# EasyEDA Pro project Cmod_Spartan7_board_2025-09-22.epro, board PCB1
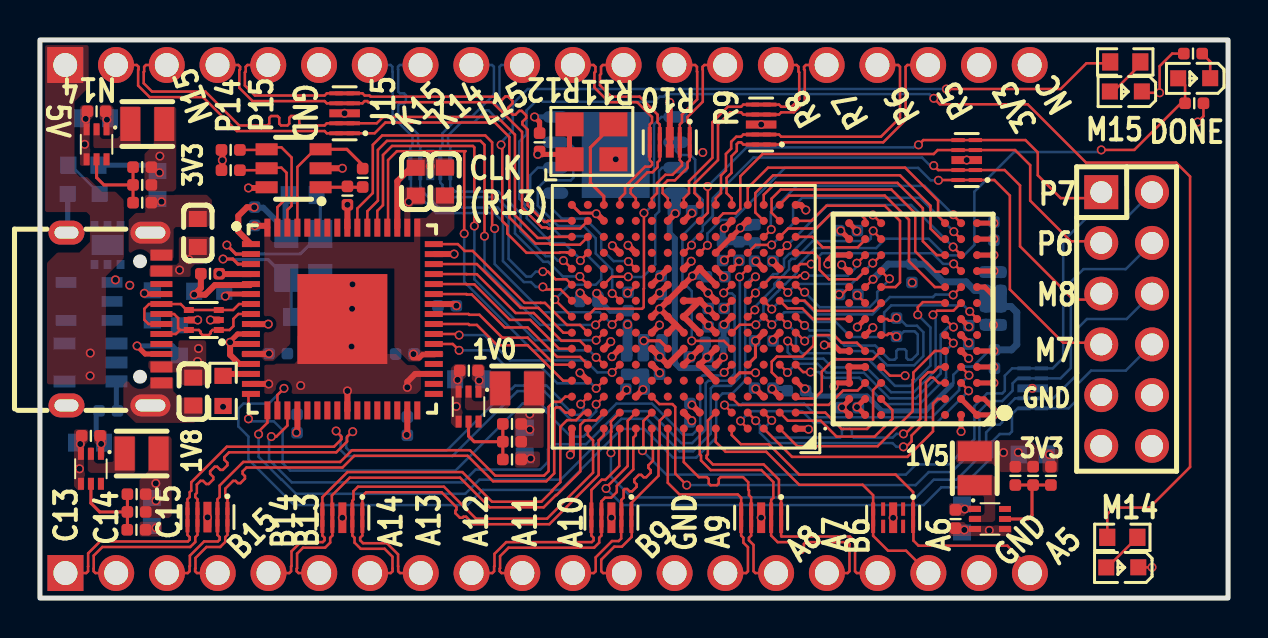
[diagram p1: board, top side]
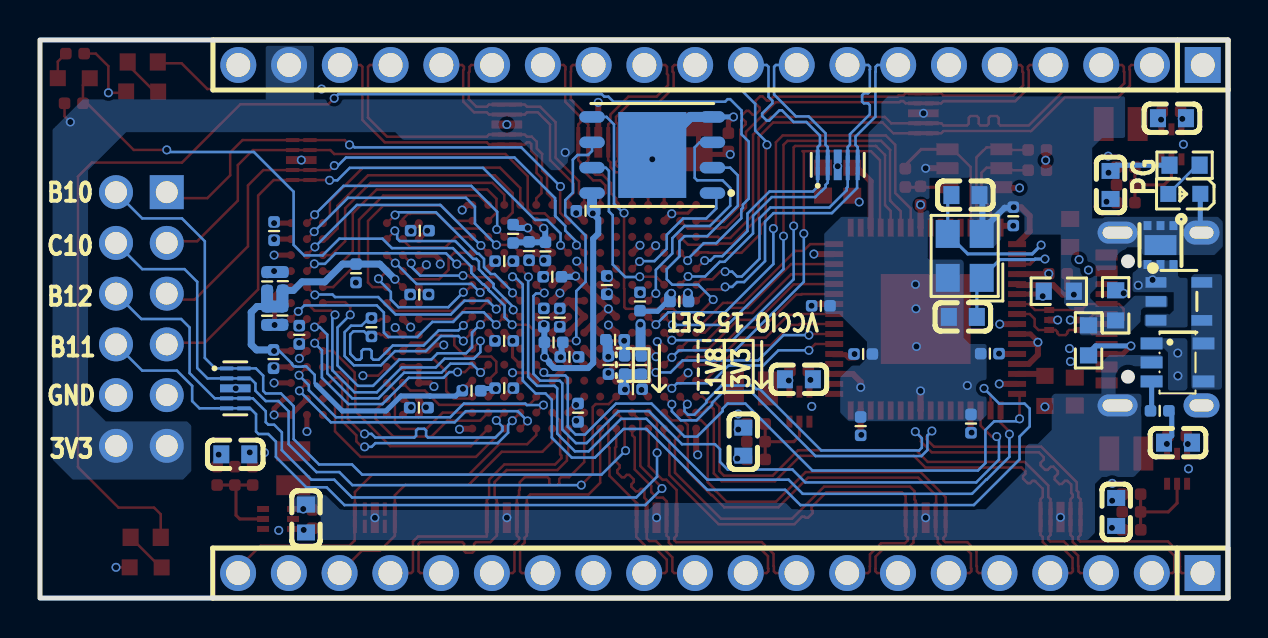
[diagram p2: board, bottom side, seen from below]

Outline 59.45 x 27.94 mm; copper layers: Top Layer, Inner1, Inner2, Bottom Layer. Coordinates in mm from the lower left corner of the outline.
Outline path: rectangle 0,27.94 59.45,0
Stack: Top Layer 0.035mm 外层铜厚1oz / Dielectric1 0.2104mm 7628 RC49% 8.6mil / Inner1 0.0152mm 内层铜厚 / Dielectric2 1.065mm 1.1mm H/HOZ Copper / Inner2 0.0152mm 内层铜厚 / Dielectric3 0.2104mm 7628 RC49% 8.6mil / Bottom Layer 0.035mm 外层铜厚1oz

## Design rules (mm)
net DDR_VREF: DDR
net DDR_CK_N: DDR, DP1
net DDR_CK_P: DDR, DP1
net DDR_A8: DDR
net DDR_A14: DDR
net DDR_A13: DDR
net DDR_RST_N: DDR
net DDR_A6: DDR
net DDR_A11: DDR
net DDR_A9: DDR
net DDR_A7: DDR
net DDR_A4: DDR
net DDR_A1: DDR
net DDR_A2: DDR
net DDR_A5: DDR
net DDR_BA1: DDR
net DDR_A12: DDR
net DDR_A0: DDR
net DDR_A3: DDR
net DDR_A15: DDR
net DDR_BA2: DDR
net DDR_BA0: DDR
net DDR_A10: DDR
net DDR_WE_N: DDR
net DDR_CS_N: DDR
net DDR_CKE: DDR
net DDR_CAS_N: DDR
net DDR_ODT: DDR
net DDR_RAS_N: DDR
net DDR_DQ5: DDR
net DDR_DQ7: DDR
net DDR_DQ4: DDR
net DDR_DQS_N: DDR, DP2
net DDR_DQ6: DDR
net DDR_DQ3: DDR
net DDR_DQ1: DDR
net DDR_DQS_P: DDR, DP2
net DDR_DQ2: DDR
net DDR_DM: DDR
net DDR_DQ0: DDR
net USB_DN: DP3
net USB_DP: DP3
net IO_L14P_C15: DP4
net IO_L14N_B15: DP4
net IO_L15N_C14: DP5
net IO_L15P_C13: DP5
net IO_L13P_B13: DP6
net IO_L13N_B14: DP6
net IO_L12P_A13: DP7
net IO_L12N_A14: DP7
net IO_L11P_A11: DP8
net IO_L11N_A12: DP8
net IO_L9P_B9: DP9
net IO_L9N_A10: DP9
net IO_L6P_A8: DP10
net IO_L6N_A9: DP10
net IO_L3P_B6: DP11
net IO_L3N_A7: DP11
net IO_L11P_P14: DP12
net IO_L11N_P15: DP12
net IO_L10P_N14: DP13
net IO_L10N_N15: DP13
net IO_L5P_J15: DP14
net IO_L5N_K15: DP14
net IO_L4N_L15: DP15
net IO_L4P_K14: DP15
net IO_L18N_R12: DP16
net IO_L18P_R11: DP16
net IO_L17P_R9: DP17
net IO_L17N_R10: DP17
net IO_L22P_R7: DP18
net IO_L22N_R8: DP18
net IO_L24P_R5: DP19
net IO_L24N_R6: DP19
template: 自定义配置
spacing copperThickness1oz (default): track to track 0.127, other pairs 0.11 to 0.3
spacing copperThickness2oz: track to track 0.203, other pairs 0.152 to 0.3
spacing copperThicknessInner0.5oz: track to track 0.089, other pairs 0.152 to 0.3
track width copperThickness1oz (default): min 0.102, default 0.127, max 2.54
track width copperThickness2oz: min 0.203, default 0.254, max 2.54
track width copperThickness0.5oz: min 0.089, default 0.254, max 2.54
differential pair differentialPair (default): width min 0.127, default 0.127, max 2.54; gap min 0.152, default 0.152
via viaSize (default): diameter min 0.3, default 0.45, max 10; hole min 0.2, default 0.305, max 6.3

## Placement (name value [footprint] x y rotation side)
C1  470nF  [C_0402 COPY(1)]  48.08 15.85 90 bottom
C9  470nF  [C_0402 COPY(1)]  36.22 10.51 180 bottom
C10  470nF  [C_0402 COPY(1)]  36.21 16.87 180 bottom
C13  470nF  [C_0402 COPY(1)]  36.22 12.87 0 bottom
C114  NAN  [C_0402 COPY(1)]  23.62 7.83 0 top
C115  22uF  [C0603]  24.26 7.83 90 bottom
C117  NAN  [C_0402 COPY(1)]  4.84 5.2 0 top
C118  22uF  [C0603]  5.6 4.31 90 bottom
C120  NAN  [C_0402 COPY(1)]  49.7 6.12 90 top
C121  22uF  [C0603]  49.68 7.2 180 bottom
C123  NAN  [C_0402 COPY(1)]  5.12 20.68 0 top
C124  22uF  [C0603]  5.88 20.68 90 bottom
C125  22uF  [C0603]  7.9 18.28 90 top
C126  470nF  [C_0402 COPY(1)]  21.46 11.38 0 top
C127  22uF  [C0603]  7.67 10.34 270 top
C128  NAN  [C_0402 COPY(1)]  2.55 8.12 0 top
C129  NAN  [C_0402 COPY(1)]  45.81 3.96 90 top
C130  NAN  [C_0402 COPY(1)]  2.83 24.37 0 top
C131  470nF  [C_0402 COPY(1)]  43.63 16.26 90 bottom
C132  470nF  [C_0402 COPY(1)]  37.85 10.38 0 bottom
C133  470nF  [C_0402 COPY(1)]  47.76 11.96 90 bottom
C134  470nF  [C_0402 COPY(1)]  46.47 13.18 90 bottom
C135  470nF  [C_0402 COPY(1)]  40.49 9.53 180 bottom
C136  470nF  [C_0402 COPY(1)]  40.44 18.39 180 bottom
C137  470nF  [C_0402 COPY(1)]  47.73 18.37 270 bottom
C139  470nF  [C_0402 COPY(1)]  48.08 14.14 90 bottom
C140  470nF  [C_0402 COPY(1)]  31 11.67 270 bottom
C141  470nF  [C_0402 COPY(1)]  32.96 12.07 180 bottom
C142  470nF  [C_0402 COPY(1)]  33.44 14.04 270 bottom
C143  470nF  [C_0402 COPY(1)]  31.09 15.67 270 bottom
C144  470nF  [C_0402 COPY(1)]  33.81 16.08 0 bottom
C145  18pF  [C0603]  13.27 14.07 0 bottom
C146  18pF  [C0603]  13.14 20.17 0 bottom
C147  470nF  [C_0402 COPY(1)]  8.51 16.24 180 top
C148  470nF  [C_0402 COPY(1)]  18.38 8.61 90 bottom
C149  470nF  [C_0402 COPY(1)]  12.86 8.73 90 bottom
C150  470nF  [C_0402 COPY(1)]  20.37 14.63 180 bottom
C153  470nF  [C_0402 COPY(1)]  10.75 19.11 90 bottom
C154  470nF  [C_0402 COPY(1)]  11.92 12.24 0 bottom
C155  470nF  [C_0402 COPY(1)]  18.26 12.22 180 bottom
C156  22uF  [C0603]  20.27 20.85 270 top
C157  22uF  [C0603]  18.8 20.84 270 top
C158  470nF  [C_0402 COPY(1)]  33.75 12.8 0 bottom
C159  470nF  [C_0402 COPY(1)]  35.77 18.24 270 bottom
C160  470nF  [C_0402 COPY(1)]  32.15 19.39 180 bottom
C161  470nF  [C_0402 COPY(1)]  27.46 14.85 180 bottom
C162  470nF  [C_0402 COPY(1)]  25 22.82 270 top
C163  470nF  [C_0402 COPY(1)]  29.78 10.46 0 bottom
C164  10uF  [C0603]  2.5 7.78 0 bottom
C165  10uF  [C0603]  2.81 24.02 0 bottom
C166  10uF  [C0603]  46.14 3.98 90 bottom
C167  10uF  [C0603]  21.47 10.95 0 bottom
C168  470nF  [C_0402 COPY(1)]  30.67 12.93 180 bottom
C169  470nF  [C_0402 COPY(1)]  32.52 9.28 90 bottom
D1  USBLC6-2P6  [SOT-666-6_L1.6-W1.2-P0.50-LS1.6-BL]  8.2 13.92 90 top
H3  -  [HDR-TH_20P-P2.54-V-M-1]  25.39 26.69 0 bottom
H4  -  [HDR-TH_20P-P2.54-V-M-1]  25.41 1.25 0 bottom
H5  -  [HDR-TH_12P-P2.54-V-M-R2-C6-S2.54]  54.37 13.97 270 top
L7  470nH  [IND-SMD_L2.0-W1.6-B]  23.87 10.5 180 top
L8  470nH  [IND-SMD_L2.0-W1.6-B]  5.09 7.23 180 top
L9  470nH  [IND-SMD_L2.0-W1.6-B]  46.77 6.5 270 top
L10  470nH  [IND-SMD_L2.0-W1.6-B]  5.37 23.73 180 top
LED1  -  [LED_0603]  54.29 25.35 180 top
LED2  -  [LED_0603]  54.11 1.53 180 top
LED3  -  [LED_0603]  2.24 20.23 0 bottom
LED4  -  [LED_0603]  57.71 26.02 180 top
R89  NAN  [R_0402 COPY(1)]  23.62 8.72 0 top
R90  NAN  [R_0402 COPY(1)]  23.62 6.94 180 top
R91  NAN  [R_0402 COPY(1)]  4.84 4.31 0 top
R92  NAN  [R_0402 COPY(1)]  4.83 3.42 180 top
R93  NAN  [R_0402 COPY(1)]  48.81 6.12 90 top
R94  NAN  [R_0402 COPY(1)]  50.58 6.12 270 top
R95  NAN  [R_0402 COPY(1)]  5.12 21.57 0 top
R96  NAN  [R_0402 COPY(1)]  5.12 19.79 180 top
R97  240R  [R_0402 COPY(1)]  40.47 15.19 0 bottom
R98  100R  [R_0402 COPY(1)]  42.86 13.56 270 bottom
R99  1K  [R_0402 COPY(1)]  47.3 15.86 90 bottom
R100  1K  [R_0402 COPY(1)]  47.32 14.15 90 bottom
R101  5K1  [R0603]  5.62 14.65 90 bottom
R102  5K1  [R0603]  6.98 12.9 270 bottom
R103  12K  [R0603]  8.47 15.36 0 bottom
R104  1K  [R0603]  9.16 10.37 90 top
R105  4.7K  [R_0402 COPY(1)]  34.98 17.37 270 bottom
R106  1K  [R_0402 COPY(1)]  34.16 17.35 270 bottom
R107  4.7K  [R_0402 COPY(1)]  34.24 14.04 90 bottom
R108  2.2K  [R_0402 COPY(1)]  16.15 21.04 90 top
R109  10K  [R_0402 COPY(1)]  15.39 20.15 90 top
R110  10K  [R_0402 COPY(1)]  9.54 21.42 0 top
R111  10K  [R_0402 COPY(1)]  9.54 22.44 0 top
R112  4.7K  [R_0402 COPY(1)]  29.43 14.85 90 bottom
R113  10K  [R0603]  54.31 26.84 180 top
R114  10K  [R0603]  54.16 3.04 180 top
R115  10K  [R0603]  2.17 21.67 0 bottom
R116  6.8K  [R_0402 COPY(1)]  3.42 9.37 0 bottom
R119  NAN  [R_0402 COPY(1)]  30.19 11.67 90 bottom
R120  NAN  [R_0402 COPY(1)]  29.36 11.66 90 bottom
R121  100R  [R_0402 COPY(1)]  57.7 27.26 180 top
R122  4.7K  [R_0402 COPY(1)]  57.76 24.77 180 top
U1  XC7S25-1CSGA225I  [CSGA-225_L13.0-W13.0-R15-C15-P0.80-TL]  32.22 14.08 180 top
U2  MT41K512M8DA-107 AIT:P  [FBGA-78_L10.5-W8.0-R13-C6-P0.80-TL]  43.69 13.97 180 top
U3  FT2232HQ-REEL  [QFN-64_L9.0-W9.0-P0.50-TL-EP4.3]  15.13 13.97 0 top
U11  TPS62A06DRLR  [SOT-563_L1.6-W1.2-P0.50-LS1.6-BR]  21.45 9.58 90 top
U12  TPS62A03ADRLR  [SOT-563_L1.6-W1.2-P0.50-LS1.6-BR]  2.55 6.47 90 top
U13  TPS62A03ADRLR  [SOT-563_L1.6-W1.2-P0.50-LS1.6-BR]  47.54 3.96 180 top
U14  TPS62A03ADRLR  [SOT-563_L1.6-W1.2-P0.50-LS1.6-BR]  2.83 22.72 90 top
U15  W25Q128JVPIQ  [WSON-8_L6.0-W5.0-P1.27-BL-EP]  28.81 22.18 90 bottom
U16  93LC56BT-I/OT  [SOT-23-6_L2.9-W1.6-P0.95-LS2.8-BR]  12.69 21.52 0 top
U20  ESD73034D-ES  [DFN2510-10_L2.5-W1.0-P0.50-BL]  8.38 4.05 180 top
U21  ESD73034D-ES  [DFN2510-10_L2.5-W1.0-P0.50-BL]  15.13 4.02 180 top
U22  ESD73034D-ES  [DFN2510-10_L2.5-W1.0-P0.50-BL]  28.59 4.02 180 top
U23  ESD73034D-ES  [DFN2510-10_L2.5-W1.0-P0.50-BL]  36.09 4.02 180 top
U24  ESD73034D-ES  [DFN2510-10_L2.5-W1.0-P0.50-BL]  42.69 4.02 180 top
U25  ESD73034D-ES  [DFN2510-10_L2.5-W1.0-P0.50-BL]  15.24 24.27 90 top
U26  ESD73034D-ES  [DFN2510-10_L2.5-W1.0-P0.50-BL]  19.53 21.69 180 bottom
U27  ESD73034D-ES  [DFN2510-10_L2.5-W1.0-P0.50-BL]  31.51 22.82 180 top
U28  ESD73034D-ES  [DFN2510-10_L2.5-W1.0-P0.50-BL]  36.09 23.7 90 top
U29  ESD73034D-ES  [DFN2510-10_L2.5-W1.0-P0.50-BL]  46.37 21.93 90 top
U30  ESD73034D-ES  [DFN2510-10_L2.5-W1.0-P0.50-BL]  49.68 10.5 270 bottom
U31  TVS0500DRVR  [WSON-6_L2.0-W2.0-P0.65-BL-EP]  3.38 17.67 0 bottom
U32  MAX40200AUK+T  [TSOT-23-5_L2.9-W1.6-P0.95-LS2.8-BL]  2.46 14.85 270 bottom
U33  MT9700  [SOT-23-5_L3.0-W1.7-P0.95-LS2.8-BR]  2.53 11.8 0 bottom
USB1  TYPE-C 16PIN 2MD(073)  [USB-C-SMD_TYPE-C-6PIN-2MD-073]  3.7 13.97 270 top
X1  12MHz  [CRYSTAL-SMD_4P-L3.2-W2.5-BL]  13.18 17.13 90 bottom
X2  50MHz  [OSC-SMD_4P-L3.2-W2.5-BL]  27.59 22.84 0 top

## Footprints (pads in the part's own frame, mm; a bottom-side part is the same pattern mirrored in y, then rotated)
C0603
  rect 0.8x0.9 smd: 1(-0.7,0) 2(0.7,0)
C_0402 COPY(1)
  custom 0.58x0.58 smd: 1(-0.46,0) 2(0.46,0)
CRYSTAL-SMD_4P-L3.2-W2.5-BL
  rect 1.4x1.2 smd: 1(-1.1,-0.85) 2(1.1,-0.85) 3(1.1,0.85) 4(-1.1,0.85)
CSGA-225_L13.0-W13.0-R15-C15-P0.80-TL
  round 0.4 smd: A1(-5.6,5.6) A2(-4.8,5.6) A3(-4,5.6) A4(-3.2,5.6) A5(-2.4,5.6) A6(-1.6,5.6) A7(-0.8,5.6) A8(0,5.6) A9(0.8,5.6) A10(1.6,5.6) A11(2.4,5.6) A12(3.2,5.6) A13(4,5.6) A14(4.8,5.6) A15(5.6,5.6) B1(-5.6,4.8) B2(-4.8,4.8) B3(-4,4.8) B4(-3.2,4.8) B5(-2.4,4.8) B6(-1.6,4.8) B7(-0.8,4.8) B8(0,4.8) B9(0.8,4.8) B10(1.6,4.8) B11(2.4,4.8) B12(3.2,4.8) B13(4,4.8) B14(4.8,4.8) B15(5.6,4.8) C1(-5.6,4) C2(-4.8,4) C3(-4,4) C4(-3.2,4) C5(-2.4,4) C6(-1.6,4) C7(-0.8,4) C8(0,4) C9(0.8,4) C10(1.6,4) C11(2.4,4) C12(3.2,4) C13(4,4) C14(4.8,4) C15(5.6,4) D1(-5.6,3.2) D2(-4.8,3.2) D3(-4,3.2) D4(-3.2,3.2) D5(-2.4,3.2) D6(-1.6,3.2) D7(-0.8,3.2) D8(0,3.2) D9(0.8,3.2) D10(1.6,3.2) D11(2.4,3.2) D12(3.2,3.2) D13(4,3.2) D14(4.8,3.2) D15(5.6,3.2) E1(-5.6,2.4) E2(-4.8,2.4) E3(-4,2.4) E4(-3.2,2.4) E5(-2.4,2.4) E6(-1.6,2.4) E7(-0.8,2.4) E8(0,2.4) E9(0.8,2.4) E10(1.6,2.4) E11(2.4,2.4) E12(3.2,2.4) E13(4,2.4) E14(4.8,2.4) E15(5.6,2.4) F1(-5.6,1.6) F2(-4.8,1.6) F3(-4,1.6) F4(-3.2,1.6) F5(-2.4,1.6) F6(-1.6,1.6) F7(-0.8,1.6) F8(0,1.6) F9(0.8,1.6) F10(1.6,1.6) F11(2.4,1.6) F12(3.2,1.6) F13(4,1.6) F14(4.8,1.6) F15(5.6,1.6) G1(-5.6,0.8) G2(-4.8,0.8) G3(-4,0.8) G4(-3.2,0.8) G5(-2.4,0.8) G6(-1.6,0.8) G7(-0.8,0.8) G8(0,0.8) G9(0.8,0.8) G10(1.6,0.8) G11(2.4,0.8) G12(3.2,0.8) G13(4,0.8) G14(4.8,0.8) G15(5.6,0.8) H1(-5.6,0) H2(-4.8,0) H3(-4,0) H4(-3.2,0) H5(-2.4,0) H6(-1.6,0) H7(-0.8,0) H8(0,0) H9(0.8,0) H10(1.6,0) H11(2.4,0) H12(3.2,0) H13(4,0) H14(4.8,0) H15(5.6,0) J1(-5.6,-0.8) J2(-4.8,-0.8) J3(-4,-0.8) J4(-3.2,-0.8) J5(-2.4,-0.8) J6(-1.6,-0.8) J7(-0.8,-0.8) J8(0,-0.8) J9(0.8,-0.8) J10(1.6,-0.8) J11(2.4,-0.8) J12(3.2,-0.8) J13(4,-0.8) J14(4.8,-0.8) J15(5.6,-0.8) K1(-5.6,-1.6) K2(-4.8,-1.6) K3(-4,-1.6) K4(-3.2,-1.6) K5(-2.4,-1.6) K6(-1.6,-1.6) K7(-0.8,-1.6) K8(0,-1.6) K9(0.8,-1.6) K10(1.6,-1.6) K11(2.4,-1.6) K12(3.2,-1.6) K13(4,-1.6) K14(4.8,-1.6) K15(5.6,-1.6) L1(-5.6,-2.4) L2(-4.8,-2.4) L3(-4,-2.4) L4(-3.2,-2.4) L5(-2.4,-2.4) L6(-1.6,-2.4) L7(-0.8,-2.4) L8(0,-2.4) L9(0.8,-2.4) L10(1.6,-2.4) L11(2.4,-2.4) L12(3.2,-2.4) L13(4,-2.4) L14(4.8,-2.4) L15(5.6,-2.4) M1(-5.6,-3.2) M2(-4.8,-3.2) M3(-4,-3.2) M4(-3.2,-3.2) M5(-2.4,-3.2) M6(-1.6,-3.2) M7(-0.8,-3.2) M8(0,-3.2) M9(0.8,-3.2) M10(1.6,-3.2) M11(2.4,-3.2) M12(3.2,-3.2) M13(4,-3.2) M14(4.8,-3.2) M15(5.6,-3.2) N1(-5.6,-4) N2(-4.8,-4) N3(-4,-4) N4(-3.2,-4) N5(-2.4,-4) N6(-1.6,-4) N7(-0.8,-4) N8(0,-4) N9(0.8,-4) N10(1.6,-4) N11(2.4,-4) N12(3.2,-4) N13(4,-4) N14(4.8,-4) N15(5.6,-4) P1(-5.6,-4.8) P2(-4.8,-4.8) P3(-4,-4.8) P4(-3.2,-4.8) P5(-2.4,-4.8) P6(-1.6,-4.8) P7(-0.8,-4.8) P8(0,-4.8) P9(0.8,-4.8) P10(1.6,-4.8) P11(2.4,-4.8) P12(3.2,-4.8) P13(4,-4.8) P14(4.8,-4.8) P15(5.6,-4.8) R1(-5.6,-5.6) R2(-4.8,-5.6) R3(-4,-5.6) R4(-3.2,-5.6) R5(-2.4,-5.6) R6(-1.6,-5.6) R7(-0.8,-5.6) R8(0,-5.6) R9(0.8,-5.6) R10(1.6,-5.6) R11(2.4,-5.6) R12(3.2,-5.6) R13(4,-5.6) R14(4.8,-5.6) R15(5.6,-5.6)
DFN2510-10_L2.5-W1.0-P0.50-BL
  rect 0.2x0.665 smd: 1(-1,-0.433) 2(-0.5,-0.433) 4(0.5,-0.433) 5(1,-0.433) 6(1,0.433) 7(0.5,0.433) 9(-0.5,0.433) 10(-1,0.433)
  rect 0.4x0.665 smd: 3(0,-0.433) 8(0,0.433)
FBGA-78_L10.5-W8.0-R13-C6-P0.80-TL
  round 0.4 smd: A1(-3.2,4.8) A2(-2.4,4.8) A3(-1.6,4.8) A7(1.6,4.8) A8(2.4,4.8) A9(3.2,4.8) B1(-3.2,4) B2(-2.4,4) B3(-1.6,4) B7(1.6,4) B8(2.4,4) B9(3.2,4) C1(-3.2,3.2) C2(-2.4,3.2) C3(-1.6,3.2) C7(1.6,3.2) C8(2.4,3.2) C9(3.2,3.2) D1(-3.2,2.4) D2(-2.4,2.4) D3(-1.6,2.4) D7(1.6,2.4) D8(2.4,2.4) D9(3.2,2.4) E1(-3.2,1.6) E2(-2.4,1.6) E3(-1.6,1.6) E7(1.6,1.6) E8(2.4,1.6) E9(3.2,1.6) F1(-3.2,0.8) F2(-2.4,0.8) F3(-1.6,0.8) F7(1.6,0.8) F8(2.4,0.8) F9(3.2,0.8) G1(-3.2,0) G2(-2.4,0) G3(-1.6,0) G7(1.6,0) G8(2.4,0) G9(3.2,0) H1(-3.2,-0.8) H2(-2.4,-0.8) H3(-1.6,-0.8) H7(1.6,-0.8) H8(2.4,-0.8) H9(3.2,-0.8) J1(-3.2,-1.6) J2(-2.4,-1.6) J3(-1.6,-1.6) J7(1.6,-1.6) J8(2.4,-1.6) J9(3.2,-1.6) K1(-3.2,-2.4) K2(-2.4,-2.4) K3(-1.6,-2.4) K7(1.6,-2.4) K8(2.4,-2.4) K9(3.2,-2.4) L1(-3.2,-3.2) L2(-2.4,-3.2) L3(-1.6,-3.2) L7(1.6,-3.2) L8(2.4,-3.2) L9(3.2,-3.2) M1(-3.2,-4) M2(-2.4,-4) M3(-1.6,-4) M7(1.6,-4) M8(2.4,-4) M9(3.2,-4) N1(-3.2,-4.8) N2(-2.4,-4.8) N3(-1.6,-4.8) N7(1.6,-4.8) N8(2.4,-4.8) N9(3.2,-4.8)
HDR-TH_12P-P2.54-V-M-R2-C6-S2.54
  rect 1.7x1.7 hole 1.1: 1(-6.35,-1.27)
  round 1.7 hole 1.1: 2(-6.35,1.27) 3(-3.81,-1.27) 4(-3.81,1.27) 5(-1.27,-1.27) 6(-1.27,1.27) 7(1.27,-1.27) 8(1.27,1.27) 9(3.81,-1.27) 10(3.81,1.27) 11(6.35,-1.27) 12(6.35,1.27)
HDR-TH_20P-P2.54-V-M-1
  rect 1.8x1.8 hole 1.2: 1(-24.13,0)
  round 1.8 hole 1.2: 2(-21.59,0) 3(-19.05,0) 4(-16.51,0) 5(-13.97,0) 6(-11.43,0) 7(-8.89,0) 8(-6.35,0) 9(-3.81,0) 10(-1.27,0) 11(1.27,0) 12(3.81,0) 13(6.35,0) 14(8.89,0) 15(11.43,0) 16(13.97,0) 17(16.51,0) 18(19.05,0) 19(21.59,0) 20(24.13,0)
IND-SMD_L2.0-W1.6-B
  rect 1x1.7 smd: 1(-0.85,0) 2(0.85,0)
LED_0603
  rect 0.8x0.8 smd: 1(-0.851,-0.01) 2(0.75,-0.005)
OSC-SMD_4P-L3.2-W2.5-BL
  rect 1.4x1.2 smd: 1(-1.1,-0.875) 2(1.1,-0.875) 3(1.1,0.875) 4(-1.1,0.875)
QFN-64_L9.0-W9.0-P0.50-TL-EP4.3
  rect 0.9x0.3 smd: 1(-4.575,3.75) 2(-4.575,3.25) 3(-4.575,2.75) 4(-4.575,2.25) 5(-4.575,1.75) 6(-4.575,1.25) 7(-4.575,0.75) 8(-4.575,0.25) 9(-4.575,-0.25) 10(-4.575,-0.75) 11(-4.575,-1.25) 12(-4.575,-1.75) 13(-4.575,-2.25) 14(-4.575,-2.75) 15(-4.575,-3.25) 16(-4.575,-3.75) 33(4.575,-3.75) 34(4.575,-3.25) 35(4.575,-2.75) 36(4.575,-2.25) 37(4.575,-1.75) 38(4.575,-1.25) 39(4.575,-0.75) 40(4.575,-0.25) 41(4.575,0.25) 42(4.575,0.75) 43(4.575,1.25) 44(4.575,1.75) 45(4.575,2.25) 46(4.575,2.75) 47(4.575,3.25) 48(4.575,3.75)
  rect 0.3x0.9 smd: 17(-3.75,-4.575) 18(-3.25,-4.575) 19(-2.75,-4.575) 20(-2.25,-4.575) 21(-1.75,-4.575) 22(-1.25,-4.575) 23(-0.75,-4.575) 24(-0.25,-4.575) 25(0.25,-4.575) 26(0.75,-4.575) 27(1.25,-4.575) 28(1.75,-4.575) 29(2.25,-4.575) 30(2.75,-4.575) 31(3.25,-4.575) 32(3.75,-4.575) 49(3.75,4.575) 50(3.25,4.575) 51(2.75,4.575) 52(2.25,4.575) 53(1.75,4.575) 54(1.25,4.575) 55(0.75,4.575) 56(0.25,4.575) 57(-0.25,4.575) 58(-0.75,4.575) 59(-1.25,4.575) 60(-1.75,4.575) 61(-2.25,4.575) 62(-2.75,4.575) 63(-3.25,4.575) 64(-3.75,4.575)
  rect 4.5x4.5 smd: 65(0,-0.001)
R0603
  rect 0.806x0.864 smd: 1(-0.753,0) 2(0.753,0)
R_0402 COPY(1)
  custom 0.58x0.58 smd: 1(-0.46,0) 2(0.46,0)
SOT-23-5_L3.0-W1.7-P0.95-LS2.8-BR
  rect 1.1x0.6 smd: 1(1.3,-0.95) 2(1.3,0) 3(1.3,0.95) 4(-1.3,0.95) 5(-1.3,-0.95)
SOT-23-6_L2.9-W1.6-P0.95-LS2.8-BR
  rect 1.1x0.6 smd: 1(1.35,-0.95) 2(1.35,0) 3(1.35,0.95) 4(-1.35,0.95) 5(-1.35,0) 6(-1.35,-0.95)
SOT-563_L1.6-W1.2-P0.50-LS1.6-BR
  rect 0.6x0.3 smd: 1(0.75,-0.5) 2(0.75,0) 3(0.75,0.5) 4(-0.75,0.5) 5(-0.75,0) 6(-0.75,-0.5)
SOT-666-6_L1.6-W1.2-P0.50-LS1.6-BL
  rect 0.3x0.5 smd: 1(-0.5,-0.75) 2(0,-0.75) 3(0.5,-0.75) 4(0.5,0.75) 5(0,0.75) 6(-0.5,0.75)
TSOT-23-5_L2.9-W1.6-P0.95-LS2.8-BL
  rect 0.532x1.045 smd: 1(-0.95,-1.147) 2(0,-1.147) 3(0.95,-1.147) 4(0.95,1.147) 5(-0.95,1.147)
USB-C-SMD_TYPE-C-6PIN-2MD-073
  rect 0.55x1.1 smd: 1(-3.2,2.375) 2(-2.4,2.375) 11(2.4,2.375) 12(3.2,2.375)
  rect 0.3x1.1 smd: 3(-1.75,2.375) 4(-1.25,2.375) 5(-0.75,2.375) 6(-0.25,2.375) 7(0.25,2.375) 8(0.75,2.375) 9(1.25,2.375) 10(1.75,2.375)
  oval 1.1x2 hole 0.6x1.5: 13(-4.325,1.825) 14(4.325,1.825)
  oval 1.2x1.8 hole 0.6x1.2: 13(-4.325,-2.375) 14(4.325,-2.375)
WSON-6_L2.0-W2.0-P0.65-BL-EP
  rect 0.4x0.45 smd: 1(-0.65,-0.975) 2(0,-0.975) 3(0.65,-0.975) 4(0.65,0.975) 5(0,0.975) 6(-0.65,0.975)
  rect 1.6x1 smd: 7(0,0)
WSON-8_L6.0-W5.0-P1.27-BL-EP
  oval 0.581x1.276 smd: 1(-1.905,-3.013) 2(-0.635,-3.013) 3(0.635,-3.013) 4(1.905,-3.013) 5(1.905,3.013) 6(0.635,3.013) 7(-0.635,3.013) 8(-1.905,3.013)
  rect 4.3x3.4 smd: 9(0,0)

## Nets
As in the schematic.

Pads without a net: H3 20; U1 C4 C6 C7 C8 C9 D3 D4 D7 D8 D9 D10 D11 D12 E3 E11 F2 F3 F4 F11 G4 G11 G12 H11 J11 K12 L10 L12 L13 L14 M3 M9 M10 M13 N4 N6 N7 N8 N9 N10 N11 N12 N13 P10 P11 P12 R14; U2 A3 A7 F1 F9 H1 H9; U3 21 22 23 24 26 27 28 29 30 32 33 34 36 57 58 59 60; U11 6; U12 6; U13 6; U14 6; U24 2 4 7 9; USB1 3 9

## Via types
v1: diameter 0.45, hole 0.305, Top Layer to Bottom Layer, 251 vias

## Routing (per net, layer and track width the routed paths; a pad name or vN(x,y) marks a point on that pad's centre or on a via; arc(x,y) is an arc through that point)
1V0: length 5.7
  Top Layer w0.3: v1(31.01,11.27) 31.01,11.29 U1.E10 ; U1.J10 v1(31.01,15.27) U1.K9 ; U1.E8 32.59,12.06 v1(32.59,12.07) 33.04,12.52 ; U1.H7 v1(33.45,13.65) U1.G6 ; 30.63,13.33 30.67,13.33 v1(31,13.67) ; U1.J6 v1(33.43,15.27) U1.K7
  vias: v1(24.51,9.22) v1(24.51,8.44)
1V8: length 11.7
  Top Layer w0.156: U1.D5 35.01,11.28 v1(35.81,11.28) ; v1(30.22,12.88) 31.02,12.88 U1.F9
  Top Layer w0.3: U1.L6 33.82,16.47 v1(34.21,16.07) ; U1.L8 32.22,16.49 v1(32.59,16.86)
  Inner2 w0.127: 34.25,16.09 34.09,16.09
  Inner2 w0.254: 35.08,9.56 34.86,9.34 34.85,9.34 34.57,9.06 34.57,9.06 34.42,8.9 34.42,8.56 ; v1(35.81,11.28) 34.94,11.28 ; 33.34,16.62 33.39,16.57 33.61,16.57 34.71,15.46 34.71,14.3 34.71,14.29 34.71,13.72 ; 30.12,15.96 30.12,16.09 30.88,16.85
  Bottom Layer w0.5: R119.2 30.19,12.86 v1(30.22,12.88)
  vias: v1(5.8,5.74) v1(5.8,4.87)
3V3: length 37.3
  Top Layer w0.127: R122.1 58.22,24.12 v1(57.93,23.83)
  Top Layer w0.254: X2.4 X2.1 26.25,22.21 v1(24.91,22.21)
  Top Layer w0.3: U1.P9 v1(31.79,19.25) ; 10.56,13.72 10.56,13.71 v1(11.42,13.71) ; U3.56 15.39,18.55 v1(15.39,19.69) ; U1.E6 v1(34.2,12.07) ; U1.J14 v1(27.03,15.27) ; v1(28.64,17.64) 29.01,17.27 29.02,17.27 ; U3.42 20.76,14.72 v1(20.84,14.63) ; 9.13,22.44 v1(9.13,21.92) 9.13,21.46 R110.1 ; v1(8.97,16.24) 8.99,16.22 10.56,16.22 ; U16.6 11.31,20.53 v1(10.43,20.53) ; 34.61,14.09 34.23,13.7 v1(34.23,13.7) ; v1(18.35,8.17) 18.38,8.2 U3.31 ; v1(12.83,8.28) 12.88,8.33 U3.20 ; U1.P5 34.25,18.52
  Bottom Layer w0.254: C124.2 5.59,21.67 R115.2
  Bottom Layer w0.3: v1(31.79,19.25) 31.51,18.98 31.51,18.24 31.77,17.99 31.77,11.77 32.02,11.51 33.65,11.51 33.66,11.52 33.72,11.52 33.97,11.76 33.97,11.83 v1(34.2,12.07) 34.2,12.74 34.18,12.76 ; 35.79,17.85 35.75,17.8 34.22,17.81 34.21,17.82 ; R107.1 34.21,13.55 C158.2 ; 34.19,18.52 34.17,18.5 34.17,17.79
  Bottom Layer w0.5: U15.8 31.82,19.33 31.8,19.3 ; 29.4,13.73 29.4,12.16 R120.2 ; 27.02,15.24 27.02,14.91 26.96,14.85
  vias: v1(6,22.12) v1(5.98,21.29) v1(9.16,9.58) v1(18.46,19.83) v1(29.41,13.69) v1(33.17,22.31) v1(34.25,18.51)
+1V5: length 12.4
  Top Layer w0.127: v1(43.29,11.13) 42.53,11.13 U2.D7
  Top Layer w0.254: 46.89,16.37 v1(47.73,16.37) ; 40.49,16.37 40.46,16.34 ; U2.A2 v1(46.09,8.34) ; U2.A9 40.49,9.19 v1(40.14,9.55) 40.49,9.9 U2.B9 ; U2.G2 46.48,13.58 v1(46.48,13.58) ; v1(39.24,12.67) 39.72,12.67 40.02,12.37 40.49,12.37 ; U2.G8 40.9,13.58 v1(40.9,13.56) ; U2.C1 v1(47.73,10.77) ; 40.46,16.34 v1(40.11,16.68) ; U2.M1 v1(47.73,17.97) ; U2.M9 v1(40.07,18.39) ; 46.13,12.34 v1(46.47,12)
  Top Layer w0.3: v1(35.82,16.87) 36.21,16.48 36.21,16.47 ; U1.G2 36.68,12.94 v1(36.68,12.92) ; 36.28,10.08 36.19,10.08 35.81,10.46 v1(35.81,10.47)
  Bottom Layer w0.6: R99.2 48.07,16.32 C1.2
  vias: v1(48.22,7.28) v1(48.95,7.29)
GND: length 101.2
  Top Layer w0.127: LED2.1 v1(55.64,1.54) ; U2.J9 40.12,15.2 v1(39.99,15.2) ; R121.2 56.66,27.26 56.03,26.63 v1(56.03,25.3) 55.15,25.3
  Top Layer w0.156: U1.E4 35.8,12.07 v1(35.8,12.88) ; 27.81,19.27 27.03,19.27 U1.R15
  Top Layer w0.2: U29.3 v1(46.37,21.93) U29.8
  Top Layer w0.254: U2.N9 40.88,18.38 v1(40.88,18.37) ; U2.D1 v1(47.73,11.57) ; v1(40.88,9.56) 40.9,9.56 U2.A8 ; U2.A1 v1(47.73,9.17) 47.73,9.48 47.25,9.97 U2.B1 ; v1(46.48,12.77) 46.48,12.78 U2.F2 ; 10.58,13.22 9.89,13.22 9.53,12.86 ; U2.L1 v1(47.73,17.17) ; 41.35,13.16 41.35,13.21 v1(41.67,13.54) ; v1(24.75,24.09) 25,23.83 C162.1 ; v1(47.71,13.67) 47.71,15.14 47.28,15.57 U2.J1 ; v1(39.73,10.59) 39.91,10.77 U2.C9 U2.D9 U2.D8 ; 40.86,9.56 40.86,9.56 41.28,9.98 ; U1.M6 U1.N5 35.04,18.51 ; U2.N1 v1(47.73,18.77) ; U2.B2 46.89,9.17 ; U2.L9 39.67,17.17 39.42,16.92 v1(39.42,16.72)
  Top Layer w0.3: v1(29.43,17.66) 29.44,17.66 U1.M11 ; U1.K6 U1.L7 U1.K8 U1.J9 v1(31.01,14.48) 31.02,14.48 U1.H9 31.82,13.68 ; 31.82,13.68 U1.G9 ; 31.82,13.68 U1.G8 ; v1(32.62,19.27) 32.6,19.27 U1.P8 ; 8.42,3.57 8.42,4 v1(8.39,4.04) ; 35.04,18.54 35.04,18.54 35.44,18.94 ; v1(31.51,24.81) U27.3 31.51,22.38 ; 28.59,4.45 v1(28.59,4.02) U22.8 ; U1.R1 38.07,19.68 v1(38.32,19.43) ; 10.56,17.72 9.92,18.35 9.92,19.13 10.36,19.56 v1(10.72,19.56) ; U25.8 v1(15.24,24.27) U25.3 ; v1(18.38,10.55) 18.38,10.83 18.77,11.22 U3.35 ; U23.8 v1(36.09,4.02) 36.09,4.45 ; v1(36.64,10.47) 36.64,10.46 U1.C2 ; v1(31.01,12.08) 30.62,12.47 U1.F10 U1.E9 U1.F8 ; 10.56,15.72 10.51,15.67 8.75,15.67 8.27,15.19 v1(7.72,15.19) 8.05,15.52 C147.2 ; U21.8 v1(15.13,4.02) 15.13,4.45 ; U28.3 v1(36.09,23.7) U28.8 ; U1.F6 v1(33.39,12.06) U1.E7 U1.D6 ; v1(28.56,12.84) 28.22,12.49 U1.F13 ; U1.H6 v1(33.46,14.44) U1.J7 ; U24.8 v1(42.69,4.02) 42.69,4.45 ; U1.D14 27.02,11.27 v1(27.02,11.27) ; U1.B8 32.22,9.28 v1(32.61,8.88) ; v1(15.39,10.37) 15.39,9.4 U3.25 ; v1(38.46,8.45) 38.43,8.48 37.8,8.48 ; C157.1 18.56,21.54 17.88,20.87 U3.51 ; U1.L9 v1(31,16.07) U1.K10 ; U1.J8 U1.J7 ; U1.J7 U1.H8 U1.G7 ; U1.A15 26.62,7.25 v1(26.54,7.17) ; v1(35.8,12.88) 35.82,12.88 36.25,13.32 ; 10.56,11.72 9.97,11.72 9.51,12.18 v1(9.51,12.81) ; U1.H10 31.01,14.47 ; 19.76,17.22 v1(20.72,17.22) ; v1(27.84,19.24) 27.86,19.24 U1.P13 ; 9.6,12.72 10.56,12.72 ; U1.C12 v1(29.35,10.42) ; U1.J13 27.86,15.24 ; U16.2 v1(15.13,21.52) ; 10.56,10.72 v1(11.45,10.72)
  Top Layer w0.35: v1(36.64,16.86) 36.64,16.86 U1.L2 ; D1.2 v1(8.53,13.92)
  Bottom Layer w0.254: USB1.13 1.39,18.36 LED3.1 ; 2.82,9.29 2.82,8.13 3.08,7.87 ; v1(24.75,24.09) U15.4 ; 28,14.9 28.54,14.36 29.43,14.36 ; 37.34,10.37 37.22,10.49 36.72,10.49
  Bottom Layer w0.3: 10.95,19.54 11.18,19.54 12.09,18.62 ; 35.73,18.72 35.53,18.53 v1(35.04,18.53) ; v1(32.65,16.12) 32.68,16.08 C144.1 ; U30.3 v1(49.65,10.5) U30.8 ; 12.37,20.19 12.29,20.12 12.29,18.62 ; U26.8 U26.3 ; 33.49,12.12 33.35,12.26 33.35,12.67 33.28,12.74 33.28,12.9
  Bottom Layer w0.5: 27.86,15.23 27.96,15.13 27.96,14.85 ; U15.9 26.91,24.09 U15.4 ; C168.1 31.04,12.84 31.04,12.06
  Bottom Layer w0.6: C139.1 47.33,13.68 47.32,13.69
  vias: v1(3.06,7.72) v1(3.35,23.95) v1(5.81,3.52) v1(6.08,19.84) v1(13.05,10.64) v1(15.64,15.7) v1(15.62,14.48) v1(15.59,12.59) v1(19.53,21.62) v1(21.98,10.89) v1(24.55,6.98) v1(27.86,15.25) v1(28.81,21.97) v1(43.64,15.79) v1(46.28,4.46) v1(50.51,7.18)
VCC:
  vias: v1(2.02,7.71) v1(1.98,6.47) v1(2.23,22.72) v1(2.29,23.99) v1(2.52,12.26) v1(2.51,11.12) v1(20.83,9.59) v1(20.9,10.92) v1(46.25,3.41) v1(47.5,3.39)
VCCIO_ADJ: length 4
  Top Layer w0.3: v1(30.17,10.44) 29.82,10.08 U1.C11 ; v1(28.62,12.08) 28.62,12.09 U1.F12 ; U1.B7 33.01,9.28 v1(32.62,9.67)
  Inner2 w0.156: 28.2,12.48 28.19,12.5 28.03,12.5 28.01,12.48 27.65,12.48 27.63,12.5 27.52,12.5
  Bottom Layer w0.254: v1(32.62,9.67) 32.57,9.71
  Bottom Layer w0.5: C163.2 30.24,11.17 R119.1 30.19,11.2 R120.1
DDR_A0: length 13
  Top Layer w0.127: 45.29,16.37 45.26,16.34 44.81,16.34 43.8,17.36 43.8,19.26 42.61,20.45 37.07,20.45 36.61,19.99 36.61,19.29 U1.P2
DDR_A1: length 6.1
  Top Layer w0.127: 36.99,15.69 37.03,15.69 v1(37.42,15.3) ; v1(41.67,16.77) 41.69,16.77 U2.L7
  Bottom Layer w0.127: v1(41.67,16.77) 41.66,16.78 41.66,16.78 40.6,15.73 37.85,15.73 v1(37.42,15.3)
DDR_A2: length 12.3
  Top Layer w0.127: U1.R3 36.22,20.19 36.81,20.78 42.91,20.78 44.18,19.51 44.18,17.86 44.87,17.17 U2.L3
DDR_A3: length 9
  Top Layer w0.127: v1(45.72,16.73) 45.73,16.73 46.09,16.37 ; U1.L1 38.05,16.72 v1(38.59,16.72)
  Bottom Layer w0.127: v1(38.59,16.72) 39.13,17.26 44.66,17.26 45.19,16.73 v1(45.72,16.73)
DDR_A4: length 5.9
  Top Layer w0.127: v1(40.88,16.76) 40.89,16.76 U2.L8 ; U1.K3 36.59,16.06 37.92,16.06 38,16.14 v1(38.28,16.14) ; 36.28,15.62 36.35,15.62
  Bottom Layer w0.127: v1(38.28,16.14) 40.42,16.14 40.88,16.59 v1(40.88,16.76)
DDR_A5: length 11.1
  Top Layer w0.127: v1(37.38,17.65) 37.38,17.64 37.05,17.31 ; v1(45.69,17.58) 46.09,17.18 U2.L2
  Bottom Layer w0.127: v1(45.69,17.58) 43.59,19.68 39.41,19.68 v1(37.38,17.65)
DDR_A6: length 3.9
  Top Layer w0.127: U2.M8 41.29,17.93 40.92,17.56 39.17,17.56 38.64,18.08 U1.N1
DDR_A7: length 13.2
  Top Layer w0.127: U2.M2 45.73,18.33 v1(45.73,18.34) ; v1(36.61,17.68) 35.81,17.68 U1.M4
  Bottom Layer w0.127: v1(36.61,17.68) 37.68,18.75 37.68,19.59 38.14,20.04 44.03,20.04 v1(45.73,18.34)
DDR_A8: length 5.1
  Top Layer w0.127: U1.N2 37.43,18.5 38.84,18.5 39.61,19.26 40.9,19.26 40.94,19.23 40.97,19.26 41,19.26 41.29,18.97 U2.N8
DDR_A9: length 13.4
  Top Layer w0.127: U1.P3 35.8,19.3 35.8,20.28 36.68,21.17 43.04,21.17 44.56,19.64 44.56,18.5 45.09,17.97 U2.M3
DDR_A10: length 4.6
  Top Layer w0.127: U1.J1 38.27,14.88 38.77,14.38 41.7,14.38 U2.H7
DDR_A11: length 9.2
  Top Layer w0.127: 35.46,14.11 35.77,14.43 ; U2.M7 41.69,18.37 v1(41.69,18.38)
  Bottom Layer w0.127: v1(35.77,14.43) 35.77,14.57 36.75,15.56 36.75,15.73 36.99,15.97 37,15.97 37.3,16.26 37.3,16.27 37.48,16.46 37.48,16.85 37.62,16.98 37.78,16.98 38.67,17.87 41.45,17.87 41.57,18 41.57,18.26 v1(41.69,18.38)
DDR_A12: length 6.6
  Top Layer w0.127: v1(42.51,15.98) 42.48,15.98 42.09,16.37 ; v1(38.27,15.31) 38.19,15.31 U1.K1
  Bottom Layer w0.127: v1(38.27,15.31) 39.01,14.56 41.51,14.56 41.89,14.94 41.89,15.32 42.51,15.94 v1(42.51,15.98)
DDR_A13: length 12.7
  Top Layer w0.127: U2.N3 44.94,19.12 44.94,19.9 43.29,21.55 36.43,21.55 35.42,20.53 U1.R4
DDR_A14: length 9
  Top Layer w0.127: v1(35.8,15.27) 35.8,15.27 U1.J4 ; v1(41.68,19.18) 42.09,18.77 U2.N7
  Bottom Layer w0.127: 36.89,16.23 37.23,16.56 37.23,16.97 37.49,17.23 37.56,17.23 39.64,19.31 41.54,19.31 v1(41.68,19.18) ; 35.8,15.32 36.69,16.22 36.89,16.22
DDR_A15: length 10
  Top Layer w0.127: U1.P1 38.59,18.88 39.35,19.64 42.27,19.64 43.04,18.88 43.04,15.8 42.81,15.57 U2.J7
DDR_BA0: length 11.1
  Top Layer w0.127: U1.J3 36.62,14.48 v1(36.62,14.47) ; 46.12,15.55 46.06,15.55 v1(45.69,15.18)
  Bottom Layer w0.127: v1(45.69,15.18) 45.67,15.2 44.81,15.2 44.69,15.07 42.53,15.07 41.65,14.2 38.89,14.2 38.21,14.88 37.03,14.88 v1(36.62,14.47)
DDR_BA1: length 4.5
  Top Layer w0.127: 41.29,16.37 41.29,16.37 40.88,15.96 39.48,15.96 39.01,16.43 39.01,17 38.73,17.28 U1.M1
DDR_BA2: length 11.6
  Top Layer w0.127: U1.R2 37.48,20.15 42.27,20.15 43.48,18.94 43.48,16.86 44.78,15.57 U2.J3
DDR_CAS_N: length 13
  Top Layer w0.127: v1(37.4,11.29) 37.4,11.3 U1.E2 ; U2.G3 45.69,13.57 v1(45.71,13.57)
  Bottom Layer w0.127: v1(45.71,13.57) 45.45,13.57 45.07,13.19 45.07,11.25 43.82,10 42.51,10 41.23,11.28 39.36,11.28 38.91,11.73 37.84,11.73 v1(37.4,11.29)
DDR_CK_N: length 11.2
  Top Layer w0.127: U2.G7 42.39,13.97 42.48,13.88 42.61,13.88 42.74,14.02 v1(42.86,14.02) ; 37.83,13.3 v1(38.26,12.87)
  Bottom Layer w0.127: R98.1 42.98,14.02 43.36,13.63 43.88,13.63 44.2,13.31 44.2,12.11 43.74,11.65 42.39,11.65 41.68,12.36 40.14,12.36 39.38,13.12 38.52,13.12 v1(38.26,12.87)
DDR_CK_P: length 11
  Top Layer w0.127: v1(38.26,13.65) 38.25,13.65 U1.H1 ; v1(42.86,13.09) 42.74,13.09 42.59,13.24 42.47,13.24 42.39,13.17 U2.F7
  Bottom Layer w0.127: R98.2 42.98,13.1 43.23,13.35 43.77,13.35 43.92,13.2 43.92,12.23 43.63,11.93 43.44,11.93 43.35,12.02 43.35,12.37 43.26,12.46 42.94,12.46 42.85,12.37 42.85,12.02 42.76,11.93 42.51,11.93 41.79,12.64 40.25,12.64 39.5,13.4 38.51,13.4 v1(38.26,13.65)
DDR_CKE: length 4
  Top Layer w0.127: U2.G9 38.68,13.97 38.15,14.5 37.41,14.5 36.94,14.97
DDR_CS_N: length 14.3
  Top Layer w0.127: U1.F1 37.43,12.87 v1(37.41,12.87) ; v1(44.69,14.18) 44.89,14.38 45.71,14.38 U2.H2
  Bottom Layer w0.127: v1(44.69,14.18) 44.82,14.05 44.82,11.4 43.72,10.3 42.59,10.3 41.35,11.55 39.64,11.55 39.2,11.98 37.74,11.98 37.41,12.31 v1(37.41,12.87)
DDR_DM: length 7.7
  Top Layer w0.127: U2.B7 42.65,9.41 42.65,8.97 41.77,8.08 39.86,8.08 39.07,8.88 37.42,8.88 U1.B2
DDR_DQ0: length 11.7
  Top Layer w0.127: U2.B3 44.92,9.97 44.69,9.73 44.69,8.35 43.41,7.07 37.63,7.07 U1.A3
DDR_DQ1: length 6.5
  Top Layer w0.127: U2.C7 42.05,10.77 41.69,10.41 41.69,8.77 41.38,8.47 40.11,8.47 39.3,9.28 U1.B1
DDR_DQ2: length 13.6
  Top Layer w0.127: v1(46.47,10.37) 46.47,10.39 U2.C2 ; U1.A4 35.05,8.85 v1(35.05,8.87)
  Bottom Layer w0.127: v1(46.47,10.37) 44.89,8.8 38.7,8.8 38.14,9.35 35.54,9.35 v1(35.05,8.87)
DDR_DQ3: length 7.4
  Top Layer w0.127: 34.56,10.09 34.97,9.67 39.47,9.67 40.19,10.39 40.91,10.39 U2.C8
DDR_DQ4: length 11.7
  Top Layer w0.127: 45.29,12.37 44.78,12.37 43.7,11.29 43.7,10.96 43.67,10.93 43.67,9.36 41.92,7.6 37.9,7.6 U1.A2
DDR_DQ5: length 6.9
  Top Layer w0.127: 41.29,12.37 40.88,12.78 40.11,12.78 39.73,13.16 38.84,13.16 38.72,13.04 38.72,12.66 38.15,12.09 36.87,12.09 36.62,11.84 36.62,11.3 37.04,10.88
DDR_DQ6: length 14.7
  Top Layer w0.127: U2.D2 46.49,11.17 v1(46.49,11.15) ; U1.B5 34.25,9.65 v1(34.25,9.66)
  Bottom Layer w0.127: v1(46.49,11.15) 45.99,10.66 45.99,10.41 44.64,9.05 38.92,9.05 38.24,9.73 35.16,9.73 35.09,9.66 v1(34.25,9.66)
DDR_DQ7: length 5.9
  Top Layer w0.127: 42.09,12.37 41.68,11.96 39.74,11.96 39.12,11.34 39.12,10.36 38.75,9.99 37.91,9.99 U1.C1
DDR_DQS_N: length 13.6
  Top Layer w0.127: U2.D3 44.96,11.57 44.7,11.31 44.44,11.31 44.05,10.92 44.05,8.97 43.29,8.21 43.22,8.21 v1(43.21,8.22) ; v1(36.62,8.89) 36.61,8.89 U1.B3
  Bottom Layer w0.127: v1(36.62,8.89) 36.3,8.58 36.3,8.39 36.66,8.03 40.04,8.03 40.13,8.12 40.13,8.38 40.22,8.47 40.54,8.47 40.63,8.38 40.63,8.12 40.72,8.03 42.67,8.03 42.86,8.22 v1(43.21,8.22)
DDR_DQS_P: length 13.7
  Top Layer w0.127: v1(35.81,8.88) 35.81,8.89 U1.B4 ; v1(43.2,7.57) 43.34,7.57 43.62,7.84 43.62,8.14 44.33,8.86 44.33,10.8 44.56,11.03 44.7,11.03 44.96,10.77 U2.C3
  Bottom Layer w0.127: v1(43.2,7.57) 42.85,7.57 42.67,7.76 36.54,7.76 36.02,8.27 36.02,8.67 v1(35.81,8.88)
DDR_ODT: length 13.2
  Top Layer w0.127: 36.16,14.08 36.22,14.08 v1(36.62,13.68) ; v1(46.52,14.35) 46.89,13.98 U2.G1
  Bottom Layer w0.127: v1(46.52,14.35) 46.22,14.65 42.59,14.65 42.24,14.3 42.24,13.29 42.01,13.07 40.57,13.07 39.82,13.82 38.77,13.82 38.29,14.31 37.24,14.31 v1(36.62,13.68)
DDR_RAS_N: length 11.3
  Top Layer w0.127: 45.7,12.78 45.32,13.17 U2.F3 ; U1.E1 38.18,11.31 v1(38.55,11.31)
  Bottom Layer w0.127: v1(45.7,12.76) 45.34,12.4 45.34,11.03 44.02,9.71 42.31,9.71 40.99,11.03 39.25,11.03 38.97,11.31 v1(38.55,11.31)
DDR_RST_N: length 12.3
  Top Layer w0.127: v1(45.7,19.19) 45.7,19.16 U2.N2 ; v1(36.59,18.45) 36.23,18.08 U1.N3
  Bottom Layer w0.127: v1(45.7,19.19) 44.26,20.63 37.87,20.63 36.57,19.34 36.57,18.45
DDR_VREF: length 26
  Top Layer w0.127: v1(41.69,15.96) 41.3,15.57 U2.J8
  Top Layer w0.254: v1(38.28,10.47) 38.23,10.47 U1.D1 ; 46.89,12.37 v1(47.73,12.37)
  Bottom Layer w0.127: 46.67,11.61 46.75,11.61 46.84,11.69 46.84,11.74 47.51,12.41 47.65,12.41 ; 46.66,11.6 46.64,11.58 46.3,11.58 46.28,11.6 46.13,11.6 45.7,11.17 45.7,10.75 45.62,10.67
  Bottom Layer w0.254: 45.62,10.67 44.32,9.37 42.13,9.37 41.38,10.12 39.94,10.12 39.93,10.11 38.64,10.11 v1(38.28,10.47)
  Bottom Layer w0.35: C139.2 48.59,14.59 48.88,14.31 48.88,12.69 48.61,12.42 C133.2 ; v1(41.69,15.96) 42.45,16.72 C131.2 44.31,16.72 45.19,15.83 46.34,15.83 46.77,15.4 R99.1
  Bottom Layer w0.6: C1.1 48.08,15.38 C139.2 47.33,14.59 R100.2 47.32,15.38 R99.1
DDR_WE_N: length 14.5
  Top Layer w0.127: v1(43.92,14.18) 43.92,14.56 44.18,14.81 45.24,14.81 U2.H3 ; 37.01,14.08 v1(37.41,13.69)
  Bottom Layer w0.127: v1(43.92,14.18) 44.56,13.55 44.56,11.64 43.54,10.62 42.78,10.62 41.47,11.94 39.87,11.94 39.55,12.26 38.13,12.26 37.83,12.55 37.83,13.29 37.39,13.73
EECLK: length 6.4
  Top Layer w0.127: R111.2 11.31,22.44 U16.4 11.44,22.56 12.08,22.56 12.59,22.05 12.59,19.64 12.38,19.43 U3.62
EECS: length 5.4
  Top Layer w0.127: R110.2 11.24,21.42 U16.5 11.37,21.55 12.08,21.55 12.34,21.29 12.34,20.02 11.88,19.57 U3.63
EEDATA: length 7.2
  Top Layer w0.127: U3.61 12.88,21.58 13.77,22.47 U16.3
  Top Layer w0.156: U16.3 15.36,22.47 16.15,21.67 R108.2
FIFO_D2: length 8.1
  Top Layer w0.127: U3.40 21.43,13.72 21.48,13.67 21.86,13.67 22.88,12.66 24.4,12.66 26.17,10.88 U1.D15
FIFO_D3: length 8
  Top Layer w0.127: U1.E15 25.76,11.68 24.4,13.04 23.13,13.04 21.99,14.18 21.48,14.18 21.44,14.22 U3.41
FIFO_D4: length 9.2
  Top Layer w0.127: U3.43 21.33,15.22 21.35,15.2 21.61,15.2 23.26,13.55 24.4,13.55 25.88,12.07 27.03,12.07 U1.E14
FIFO_D5: length 8.2
  Top Layer w0.127: U3.44 21.34,15.72 21.35,15.7 21.74,15.7 23.51,13.93 24.53,13.93 25.97,12.48 U1.F15
FIFO_D6: length 9.3
  Top Layer w0.127: U3.45 21.35,16.22 21.35,16.21 21.86,16.21 23.8,14.27 24.7,14.27 26.1,12.88 27.02,12.88 U1.F14
FIFO_D7: length 8.3
  Top Layer w0.127: U3.46 21.86,16.72 24.06,14.53 24.95,14.53 26.19,13.28 U1.G15
FIFO_RD: length 23
  Top Layer w0.127: v1(27.83,12.91) 27.84,12.91 U1.G13 ; v1(21.74,18.62) 21.74,22.56 21.67,22.63 17.61,22.63 17.16,22.18 17.16,19.67 16.88,19.39 U3.53
  Bottom Layer w0.127: v1(21.74,18.62) 21.74,15.96 24.78,12.91 27.83,12.91
FIFO_RXF: length 9.5
  Top Layer w0.127: U1.G14 27.03,13.67 26.37,13.67 25.27,14.78 25.06,14.78 25.05,14.78 24.25,14.78 21.65,17.38 21.25,17.38 20.91,17.72 U3.48
FIFO_SIWUB: length 24.6
  Top Layer w0.127: U3.55 15.88,19.5 16.66,20.28 16.66,22.69 17.12,23.16 22.28,23.16 22.62,22.82 22.62,18.62 v1(22.75,18.5) ; U1.H12 28.63,13.7 v1(28.63,13.69)
  Bottom Layer w0.127: v1(22.75,18.5) 22.75,16.72 25.16,14.31 28.01,14.31 v1(28.63,13.69)
FIFO_TXE: length 22.7
  Top Layer w0.127: U1.E13 27.85,12.05 v1(27.83,12.05) ; U3.52 17.42,18.58 17.42,21.93 17.86,22.37 21.29,22.37 21.23,22.31 v1(21.23,18.24)
  Bottom Layer w0.127: v1(27.83,12.05) 27.48,12.4 24.66,12.4 21.23,15.83 v1(21.23,18.24)
FIFO_WR: length 23.2
  Top Layer w0.127: U1.H13 27.8,13.67 27.8,13.67 ; v1(22.24,18.12) 22.24,22.69 22.05,22.89 17.36,22.89 16.91,22.44 16.91,19.9 16.38,19.37 U3.54
  Bottom Layer w0.127: v1(27.8,13.68) 27.8,13.67 25.04,13.67 22.24,16.47 v1(22.24,18.12)
FT_1V8: length 2.7
  Top Layer w0.254: 18.65,12.02 18.98,12.02 19.14,12.18 19.76,12.18
  Top Layer w0.3: 10.56,12.22 11.45,12.22 ; U3.64 11.29,18.64 v1(10.75,18.64)
  vias: v1(11.46,12.24) v1(18.69,12.21)
IO_L3N_A7: length 15.9
  Top Layer w0.127: U23.9 36.59,3.13 36.92,2.8 37.64,2.8 37.73,2.71 37.73,2.36 37.82,2.27 38.14,2.27 38.23,2.36 38.23,2.71 38.32,2.8 40.42,2.8 40.51,2.71 40.51,1.34 40.42,1.25 H4.16 ; U1.A7 33.02,7.2 33.08,7.13 33.08,6.89 33.56,6.41 36.1,6.41 36.7,5.81 36.7,5.02 36.59,4.91 36.59,4.45
  Top Layer w0.2: 36.59,4.45 U23.9
IO_L3P_B6: length 15.9
  Top Layer w0.127: U23.10 37.09,3.1 37.11,3.08 40.53,3.08 40.79,2.83 40.79,1.34 40.87,1.25 H4.17 ; 37.09,4.45 37.09,4.91 36.98,5.02 36.98,5.92 36.21,6.69 33.67,6.69 33.36,7 33.36,7.13 33.42,7.2 33.42,8.89 U1.B6
  Top Layer w0.2: 37.09,4.45 U23.10
IO_L4N_L15: length 18.6
  Top Layer w0.127: v1(26.19,16.89) 26.21,16.89 U1.L15
  Bottom Layer w0.127: U26.10 20.53,22.58 20.42,22.69 20.42,23.15 21.1,23.83 21.74,23.83 22.32,24.42 22.45,24.42 22.96,23.9 23.09,23.9 23.31,24.13 23.31,24.26 22.8,24.77 22.8,24.9 22.99,25.09 22.99,26.6 23.08,26.69 H3.10 ; U26.1 20.53,20.59 20.77,20.35 22.94,20.35 24.05,19.25 24.05,18.37 25.3,17.11 25.68,17.11 25.91,16.89 v1(26.19,16.89)
  Bottom Layer w0.2: U26.10 U26.1
IO_L4P_K14: length 18.6
  Top Layer w0.127: v1(27.02,16.1) 27.02,16.08 U1.K14
  Bottom Layer w0.127: H3.9 22.62,26.69 22.71,26.6 22.71,25.21 21.62,24.11 20.98,24.11 20.14,23.27 20.14,22.69 20.03,22.58 U26.9 ; U26.2 20.03,20.79 20.14,20.68 20.14,20.57 20.33,20.37 20.35,20.37 20.65,20.07 22.83,20.07 23.77,19.13 23.77,18.26 25.19,16.83 25.43,16.83 26.17,16.1 v1(27.02,16.1)
  Bottom Layer w0.2: U26.9 U26.2
IO_L5N_A6: length 15.2
  Top Layer w0.127: U1.A6 33.82,7.81 34.31,7.32 36.34,7.32 37.99,5.67 41.17,5.67 41.69,5.15 41.69,4.45 ; H4.18 43.34,2.37 42.44,2.37 41.69,3.12 U24.6
  Top Layer w0.2: 41.69,4.45 U24.6
IO_L5N_K15: length 19.3
  Top Layer w0.127: v1(25.16,16.34) 25.42,16.34 25.8,15.96 26.34,15.96 U1.K15
  Bottom Layer w0.127: 19.04,26.69 18,26.69 17.91,26.6 17.91,26.47 17.93,26.46 17.93,25.36 18.02,25.27 18.22,25.27 18.31,25.18 18.31,24.86 18.22,24.77 18.02,24.77 17.93,24.68 17.93,24.21 18.92,23.22 18.92,22.69 19.03,22.58 U26.7 ; U26.4 19.03,20.58 19.08,20.53 19.08,20.42 19.95,19.55 22.9,19.55 23.45,19 23.45,16.98 24.33,16.1 24.57,16.1 24.81,16.34 v1(25.16,16.34)
  Bottom Layer w0.2: U26.7 U26.4
IO_L5P_A5: length 19.7
  Top Layer w0.127: H4.20 49.54,1.49 48.41,2.62 43.96,2.62 43.71,2.88 43.71,3.57 U24.10 ; 43.69,4.45 43.69,5.31 42.82,6.18 37.99,6.18 36.47,7.7 35.07,7.7 34.62,8.16 U1.A5
  Top Layer w0.2: 43.69,4.45 U24.10
IO_L5P_J15: length 19.3
  Top Layer w0.127: v1(25.16,15.58) 25.29,15.45 26.05,15.45 U1.J15
  Bottom Layer w0.127: U26.6 18.53,22.58 18.64,22.69 18.64,23.1 17.65,24.1 17.65,26.34 17.63,26.35 17.63,26.6 17.55,26.69 H3.7 ; U26.5 18.56,21.22 18.56,20.53 19.82,19.27 22.74,19.27 23.17,18.85 23.17,16.87 24.22,15.82 24.57,15.82 24.81,15.58 v1(25.16,15.58)
  Bottom Layer w0.2: U26.6 U26.5
IO_L6N_A9: length 11.7
  Top Layer w0.127: U1.A9 31.42,5.77 32,5.19 34.92,5.19 35.09,5.02 35.09,4.45 ; H4.14 35.34,1.25 35.43,1.34 35.43,2.55 35.2,2.77 35.2,3.02 35.09,3.13 U23.6
  Top Layer w0.2: 35.09,4.45 U23.6
IO_L6P_A8: length 11.7
  Top Layer w0.127: U1.A8 32.22,6.81 32.97,6.05 33.37,6.05 33.46,5.96 33.46,5.74 33.55,5.65 33.87,5.65 33.96,5.74 33.96,5.96 34.05,6.05 35.19,6.05 35.44,5.8 35.44,5.43 35.48,5.39 35.48,5.15 35.59,5.04 35.59,4.45 ; U23.7 35.59,3.13 35.48,3.02 35.48,2.89 35.7,2.66 35.7,1.34 35.8,1.25 H4.15
  Top Layer w0.2: 35.59,4.45 U23.7
IO_L9N_A10: length 10.7
  Top Layer w0.127: 29.09,4.45 29.09,4.91 29.2,5.02 29.2,5.41 29.26,5.46 29.38,5.46 29.5,5.34 29.63,5.34 29.85,5.57 29.85,5.69 29.74,5.81 29.74,5.94 29.96,6.17 30.09,6.17 30.21,6.05 30.33,6.05 30.56,6.27 30.56,6.4 30.44,6.52 30.44,6.65 30.67,6.87 30.67,7.52 30.62,7.58 U1.A10 ; U22.9 29.08,3.58 29.08,2.98 28.96,2.85 28.62,2.85 27.81,2.04 27.81,1.34 27.72,1.25 H4.11
  Top Layer w0.2: 29.09,4.45 U22.9
IO_L9P_B9: length 10.7
  Top Layer w0.127: U22.10 29.61,3.57 29.61,3.06 29.12,2.57 28.74,2.57 28.08,1.92 28.08,1.34 28.17,1.25 H4.12 ; 29.59,4.45 29.59,4.77 30.95,6.12 30.95,7.52 31.01,7.58 31.01,8.87 U1.B9
  Top Layer w0.2: 29.59,4.45 U22.10
IO_L10N_N15: length 30.8
  Top Layer w0.127: 6.34,26.69 5.3,26.69 5.21,26.6 5.21,26.35 5.19,26.33 5.19,25.77 5.61,25.36 8.27,25.36 9.97,23.66 11.38,23.66 11.47,23.75 11.47,24.04 11.56,24.13 11.88,24.13 11.97,24.04 11.97,23.75 12.06,23.66 12.38,23.66 12.47,23.75 12.47,24.04 12.56,24.13 12.88,24.13 12.97,24.04 12.97,23.75 13.06,23.66 14.24,23.66 14.35,23.77 U25.9 ; U25.2 16.85,23.77 17.17,24.09 22.88,24.09 23.77,23.2 23.77,19.17 24.91,18.03 25.47,18.03 25.53,18.08 26.62,18.08
  Top Layer w0.2: U25.2 U25.9
IO_L10P_N14: length 30.9
  Top Layer w0.127: H3.2 4.84,26.69 4.93,26.6 4.93,26.47 4.91,26.45 4.91,25.66 5.49,25.08 8.16,25.08 9.86,23.38 14.24,23.38 14.35,23.27 U25.10 ; U1.N14 27.02,17.69 25.55,17.69 25.5,17.75 24.8,17.75 23.49,19.05 23.49,23.08 22.76,23.81 17.29,23.81 16.75,23.27 U25.1
  Top Layer w0.2: U25.1 U25.10
IO_L11N_A12: length 13.6
  Top Layer w0.127: 28.28,5.91 28.99,6.61 28.99,8.45 U1.A12 ; U22.6 27.59,3.13 27.7,3.02 27.7,2.89 27.61,2.8 23.33,2.8 22.74,2.21 22.74,1.6 22.73,1.58 22.73,1.34 22.64,1.25 H4.9 ; 27.59,4.45 27.59,5.41 28.11,5.92 28.27,5.92
  Top Layer w0.2: 27.59,4.45 U22.6
IO_L11N_P15: length 25.1
  Top Layer w0.127: U25.6 14.35,25.27 14.24,25.16 10.75,25.16 10.25,25.66 10.25,26.31 10.29,26.35 10.29,26.6 10.38,26.69 H3.5 ; U25.5 16.14,25.27 16.25,25.16 16.49,25.16 16.55,25.1 22.75,25.1 22.95,24.9 23.08,24.9 23.29,25.11 23.42,25.11 23.64,24.89 23.64,24.76 23.43,24.55 23.43,24.42 23.66,24.2 23.79,24.2 23.98,24.39 24.11,24.39 24.33,24.16 24.33,24.03 24.14,23.84 24.14,23.71 24.4,23.45 24.4,19.66 25.23,18.83 25.36,18.83 25.41,18.88 U1.P15
  Top Layer w0.2: U25.5 U25.6
IO_L11P_A11: length 13.8
  Top Layer w0.127: 28.09,4.45 28.09,4.84 28.27,5.03 28.58,5.03 28.86,5.31 28.86,5.61 29.69,6.44 29.69,8.03 29.82,8.16 U1.A11 ; U22.7 28.09,3.13 27.98,3.02 27.98,2.77 27.73,2.52 23.45,2.52 23.02,2.1 23.02,1.49 23.01,1.47 23.01,1.34 23.09,1.25 H4.10
  Top Layer w0.2: 28.09,4.45 U22.7
IO_L11P_P14: length 25.1
  Top Layer w0.127: U25.7 14.35,24.77 14.24,24.88 10.64,24.88 9.97,25.54 9.97,26.43 10.01,26.47 10.01,26.6 9.92,26.69 8.88,26.69 ; U25.4 16.14,24.77 16.25,24.88 16.37,24.88 16.43,24.82 22.64,24.82 24.12,23.34 24.12,19.55 25.12,18.55 25.37,18.55 25.42,18.5 27.03,18.5 U1.P14
  Top Layer w0.2: U25.4 U25.7
IO_L12N_A14: length 22.7
  Top Layer w0.127: 15.63,4.45 15.63,4.87 15.69,4.93 15.69,5.35 15.91,5.58 20.21,5.58 21.81,3.98 25.37,3.98 27.68,6.28 27.68,7.9 27.42,8.16 U1.A14 ; U21.9 15.63,3.13 15.74,3.02 15.74,2.77 16.05,2.47 17.24,2.47 17.64,2.07 17.64,1.48 17.65,1.47 17.65,1.34 17.56,1.25 H4.7
  Top Layer w0.2: 15.63,4.45 U21.9
IO_L12P_A13: length 22.8
  Top Layer w0.127: U1.A13 28.22,8.16 27.96,7.9 27.96,6.16 25.49,3.7 21.7,3.7 21.32,4.07 21.19,4.07 21.14,4.02 21.01,4.02 20.79,4.25 20.79,4.37 20.84,4.43 20.84,4.55 20.1,5.3 16.32,5.3 16.13,5.11 16.13,4.45 ; H4.8 18.02,1.25 17.92,1.34 17.92,1.58 17.92,1.59 17.92,2.19 17.36,2.75 16.17,2.75 16.02,2.89 16.02,3.02 16.13,3.13 U21.10
  Top Layer w0.2: 16.13,4.45 U21.10
IO_L13N_B14: length 24.2
  Top Layer w0.127: 25.64,5.37 25.62,5.35 ; 25.62,5.35 25.09,4.82 22.62,4.82 21.13,6.31 15.39,6.31 14.13,5.05 14.13,4.45 ; 25.62,5.35 25.62,5.39 26.04,5.81 26.04,8.57 26.37,8.91 26.83,8.91 27.2,9.28 U1.B14 ; H4.5 12.48,1.25 12.57,1.34 12.57,1.58 12.59,1.61 12.59,2.34 13.05,2.8 14.15,2.8 14.24,2.89 14.24,3.02 14.13,3.13 U21.6
  Top Layer w0.2: 14.13,4.45 U21.6
IO_L13P_B13: length 24.3
  Top Layer w0.127: H4.6 12.93,1.25 12.84,1.34 12.84,1.47 12.87,1.49 12.87,2.23 13.16,2.52 14.27,2.52 14.52,2.77 14.52,3.02 14.63,3.13 U21.7 ; U1.B13 27.83,8.89 27.26,8.89 27.03,8.67 27.03,6.33 25.85,5.16 25.82,5.16 25.21,4.54 22.5,4.54 21.02,6.03 15.5,6.03 14.61,5.13 14.61,4.59 14.63,4.57 14.63,4.45
  Top Layer w0.2: 14.63,4.45 U21.7
IO_L14N_B15: length 29
  Top Layer w0.127: U20.1 9.38,4.95 9.27,5.06 9.27,5.47 9.66,5.87 9.79,5.87 9.9,5.75 10.03,5.75 10.26,5.98 10.26,6.11 10.14,6.22 10.14,6.35 10.33,6.53 15.14,6.53 15.73,7.12 21.4,7.12 22.67,5.85 25.34,5.85 25.73,6.24 25.73,9.45 25.82,9.54 26.03,9.54 26.29,9.28 U1.B15 ; U20.10 9.38,3.16 9.27,3.05 9.27,2.81 9.02,2.55 8.33,2.55 7.78,2.01 7.78,1.48 7.77,1.47 7.77,1.34 7.86,1.25 H4.4
  Top Layer w0.2: U20.1 U20.10
IO_L14P_C15: length 29
  Top Layer w0.127: H4.3 7.4,1.25 7.49,1.34 7.49,1.58 7.5,1.6 7.5,2.12 8.21,2.83 8.9,2.83 8.99,2.92 8.99,3.05 8.88,3.16 U20.9 ; U1.C15 26.29,10.08 26.03,9.82 25.7,9.82 25.45,9.57 25.45,6.36 25.22,6.13 22.79,6.13 21.51,7.4 15.61,7.4 15.02,6.81 10.17,6.81 8.99,5.63 8.99,5.06 8.88,4.95 U20.2
  Top Layer w0.2: U20.2 U20.9
IO_L15N_C14: length 36.4
  Top Layer w0.127: 27.41,10.06 27.06,9.71 v1(27.06,9.71) ; U20.7 7.88,3.16 7.77,3.05 7.77,2.81 7.52,2.55 3.12,2.55 2.69,2.12 2.69,1.47 2.69,1.47 2.69,1.34 2.77,1.25 H4.2 ; U20.4 7.88,4.95 7.77,5.06 7.77,5.18 7.85,5.26 7.85,5.68 8.03,5.87 8.16,5.87 8.32,5.71 8.44,5.71 8.67,5.94 8.67,6.06 8.51,6.22 8.51,6.35 8.74,6.57 8.87,6.57 9.02,6.42 9.15,6.42 9.38,6.64 9.38,6.77 9.22,6.93 9.22,7.05 9.46,7.3 14.83,7.3 15.37,7.84 15.37,8.08 15.62,8.33 v1(15.65,8.33)
  Top Layer w0.2: U20.4 U20.7
  Bottom Layer w0.127: v1(15.65,8.33) 15.32,8 15.32,7.52 15.46,7.39 20.35,7.39 23.43,10.46 23.6,10.46 23.77,10.64 25.34,10.64 26.1,9.88 26.1,9.79 26.71,9.18 27.02,9.18 27.2,9.35 27.2,9.57 v1(27.06,9.71)
IO_L15P_C13: length 36.4
  Top Layer w0.127: U20.5 7.38,4.95 7.49,5.06 7.49,5.3 7.57,5.38 7.57,5.8 9.35,7.58 14.71,7.58 15.09,7.95 15.09,8.08 14.82,8.35 v1(14.82,8.36) ; U20.6 7.38,3.16 7.49,3.05 7.49,2.92 7.4,2.83 3,2.83 2.41,2.24 2.41,1.59 2.41,1.58 2.41,1.34 2.32,1.25 H4.1 ; U1.C13 27.83,9.7
  Top Layer w0.2: U20.5 U20.6
  Bottom Layer w0.127: v1(14.82,8.36) 15.04,8.14 15.04,7.41 15.34,7.11 20.64,7.11 23.89,10.36 25.23,10.36 25.82,9.77 25.82,9.67 26.59,8.9 27.38,8.9 27.83,9.35 v1(27.83,9.7)
IO_L17N_R10: length 9.3
  Top Layer w0.127: U1.R10 30.62,20.01 30.88,20.27 30.88,20.77 31.29,21.19 31.65,21.19 32.12,21.66 32.12,21.81 32.01,21.92 32.01,22.38 ; H3.13 32.79,26.69 32.87,26.6 32.87,26.35 32.89,26.34 32.89,24.96 32.12,24.2 32.12,23.82 32.01,23.71 U27.2
  Top Layer w0.2: 32.01,22.38 U27.2
IO_L17P_R9: length 9.3
  Top Layer w0.127: U1.R9 31.42,20.01 31.16,20.27 31.16,20.66 31.41,20.91 31.77,20.91 32.4,21.55 32.4,21.81 32.51,21.92 32.51,22.38 ; 34.28,26.69 33.24,26.69 33.15,26.6 33.15,26.47 33.17,26.46 33.17,24.85 32.4,24.09 32.4,23.82 32.51,23.71 U27.1
  Top Layer w0.2: 32.51,22.38 U27.1
IO_L18N_R12: length 11
  Top Layer w0.127: U27.5 30.51,23.71 30.62,23.82 30.62,24.09 29.89,24.82 28.48,24.82 27.74,25.56 27.74,26.3 27.79,26.35 27.79,26.6 27.7,26.69 26.66,26.69 ; U1.R12 29.02,20.01 29.28,20.27 29.28,20.59 30.28,21.6 30.54,21.6 30.62,21.69 30.62,21.81 30.51,21.92 30.51,22.38
  Top Layer w0.2: 30.51,22.38 U27.5
IO_L18P_R11: length 11
  Top Layer w0.127: U27.4 31.01,23.71 30.9,23.82 30.9,24.2 30,25.1 28.59,25.1 28.02,25.67 28.02,26.19 28.07,26.24 28.07,26.6 28.16,26.69 H3.12 ; 31.01,22.38 31.01,21.92 30.9,21.81 30.9,21.57 30.65,21.32 30.4,21.32 29.56,20.48 29.56,20.27 29.82,20.01 U1.R11
  Top Layer w0.2: 31.01,22.38 U27.4
IO_L22N_R8: length 12.4
  Top Layer w0.127: U28.6 35.19,24.7 35.08,24.59 34.42,24.59 33.65,23.82 33.65,22.04 32.48,20.87 32.48,20.27 32.22,20.01 U1.R8 ; 36.82,26.69 37.86,26.69 37.95,26.6 37.95,26.35 37.99,26.32 37.99,24.98 37.61,24.59 37.09,24.59 36.98,24.7 U28.5
  Top Layer w0.2: U28.6 U28.5
IO_L22P_R7: length 12.4
  Top Layer w0.127: H3.16 38.32,26.69 38.23,26.6 38.23,26.47 38.27,26.43 38.27,24.86 37.73,24.32 37.09,24.32 36.98,24.2 U28.4 ; U1.R7 33.02,20.01 32.76,20.27 32.76,20.76 33.93,21.93 33.93,23.7 34.54,24.32 35.08,24.32 35.19,24.2 U28.7
  Top Layer w0.2: U28.7 U28.4
IO_L24N_R6: length 16.2
  Top Layer w0.127: U1.R6 33.82,20.01 34.08,20.27 34.08,21.15 34.32,21.4 34.32,22.24 34.59,22.5 34.59,22.84 34.84,23.09 35.08,23.09 35.19,23.2 U28.9 ; U28.2 36.98,23.2 37.09,23.09 42.08,23.09 43.03,24.05 43.03,26.6 42.95,26.69 H3.17
  Top Layer w0.2: U28.9 U28.2
IO_L24P_R5: length 16.2
  Top Layer w0.127: 44.44,26.69 43.4,26.69 43.31,26.6 43.31,23.93 42.2,22.82 37.09,22.82 36.98,22.7 U28.1 ; U1.R5 34.62,20.01 34.36,20.27 34.36,21.04 34.6,21.29 34.6,22.12 34.87,22.38 34.87,22.73 34.96,22.82 35.08,22.82 35.19,22.7 U28.10
  Top Layer w0.2: U28.10 U28.1
JTAG_TCK: length 33.9
  Top Layer w0.127: v1(34.24,11.3) 34.24,11.3 U1.E5 ; 10.56,10.22 10.43,10.09 v1(10.43,8.97)
  Bottom Layer w0.127: v1(34.24,11.3) 34.08,11.14 33.16,11.14 33.04,11.02 33.04,8.57 32.65,8.19 32.17,8.19 30.63,9.73 28.85,9.73 27.2,8.08 26.56,8.08 25.29,9.35 25.29,9.48 25.04,9.73 24.15,9.73 20.8,6.38 12.51,6.38 12.14,6.76 12.14,8.41 11.7,8.85 10.56,8.85 v1(10.43,8.97) ; 34.25,11.3 34.24,11.29
JTAG_TDI: length 38
  Top Layer w0.127: U3.17 11.38,8.78 10.94,8.34 v1(10.94,8.2) ; v1(35.01,16.08) 35.01,16.09 35.39,16.48
  Bottom Layer w0.127: v1(10.94,8.2) 10.94,7.07 12.08,5.93 12.11,5.93 12.81,5.22 21.28,5.22 21.99,5.93 26.05,5.93 29.1,8.97 30.37,8.97 32,7.34 32.68,7.34 33.57,8.23 33.57,10.5 33.69,10.62 34.57,10.62 35.02,11.07 35.02,15.88 34.92,15.97 34.92,16.05
JTAG_TDO: length 43.5
  Top Layer w0.127: 35.37,15.64 35.8,16.08 v1(35.8,16.08) ; U3.18 11.88,10.17 v1(12.21,10.5)
  Bottom Layer w0.127: v1(12.21,10.5) 11.45,9.73 10.18,9.73 9.92,9.48 9.92,8.59 10.43,8.08 10.43,6.94 12.72,4.66 21.4,4.66 22.16,5.42 26.05,5.42 29.1,8.47 30.24,8.47 31.68,7.03 32.84,7.03 33.84,8.03 33.84,9.93 34.15,10.24 34.65,10.24 35.29,10.89 35.29,15.69 35.71,16.11 35.77,16.11
JTAG_TMS: length 37.1
  Top Layer w0.127: U3.19 12.38,8.64 11.83,8.08 v1(11.58,8.08) ; U1.K5 34.21,15.28 v1(34.21,15.27)
  Bottom Layer w0.127: v1(11.58,8.08) 11.46,7.97 11.46,6.93 12.6,5.79 21.15,5.79 21.8,6.43 25.04,6.43 25.42,6.81 25.42,7.45 25.67,7.7 27.32,7.7 28.97,9.35 30.5,9.35 32.1,7.76 32.63,7.76 33.31,8.44 33.31,10.75 33.44,10.88 34.41,10.88 34.76,11.22 34.76,15.12 34.63,15.25 34.26,15.25
PMOD_IO0_P7: length 24.6
  Top Layer w0.127: v1(43.96,22.69) 44.2,22.93 U29.6 U29.5 49.31,22.93 49.93,22.31 49.93,21.17 51.07,20.02 52.81,20.02 H5.1 ; v1(33.41,20.61) 33.42,20.59 33.42,19.29 U1.P7
  Bottom Layer w0.127: v1(33.41,20.61) 35.36,22.56 43.71,22.56 43.83,22.69 v1(43.96,22.69)
PMOD_IO1_P6: length 24.7
  Top Layer w0.127: U1.P6 34.19,19.26 34.82,19.26 35.04,19.49 35.04,21.11 36.16,22.23 44.72,22.23 44.92,22.43 U29.7 U29.4 48.79,22.43 49.55,21.67 49.55,19.9 51.58,17.86 53.02,17.86 H5.3
PMOD_IO2_M8: length 29.3
  Top Layer w0.127: H5.5 52.81,14.94 51.71,14.94 49.04,17.61 49.04,20.66 48.27,21.43 U29.2 U29.9 44.94,21.43 v1(44.72,21.65) ; v1(32.6,17.66) 32.6,17.66 U1.M8
  Bottom Layer w0.127: 33.66,19.12 33.66,19.89 33.67,19.9 ; 33.66,19.12 33.67,19.13 33.67,19.9 ; 33.66,19.12 33.17,18.62 33.17,18.4 32.6,17.84 v1(32.6,17.66) ; 33.67,19.9 33.67,20.02 35.71,22.05 44.14,22.05 44.54,21.65 v1(44.72,21.65)
